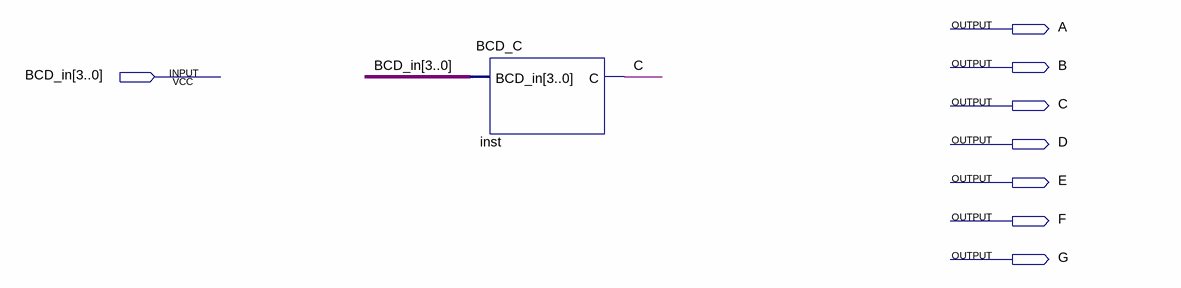
[diagram p0: schematic sheet]
// Quartus schematic BCD_7seg.bdf as structural Verilog: 1 symbols, 8 pins
module BCD_7seg (
  input  [3:0] BCD_in,
  output A,
  output B,
  output C,
  output D,
  output E,
  output F,
  output G
);

  BCD_C inst (.BCD_in(BCD_in), .C(C));
endmodule
